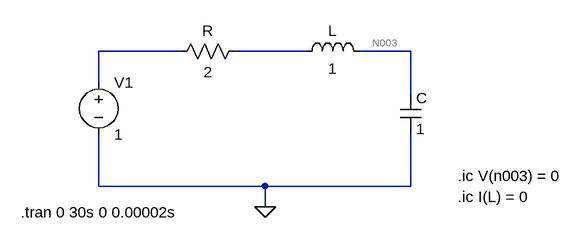
[diagram p0: schematic Q1(iii).asc]
Q1(iii).asc, the LTspice schematic file:
Version 4
SHEET 1 1360 680
WIRE 176 -208 48 -208
WIRE 368 -208 256 -208
WIRE 528 -208 448 -208
WIRE 48 -160 48 -208
WIRE 528 -144 528 -208
WIRE 48 0 48 -80
WIRE 304 0 48 0
WIRE 528 0 528 -80
WIRE 528 0 304 0
WIRE 304 32 304 0
FLAG 304 32 0
SYMBOL voltage 48 -176 R0
WINDOW 123 0 0 Left 0
WINDOW 39 0 0 Left 0
SYMATTR InstName V1
SYMATTR Value 1
SYMBOL res 272 -224 R90
WINDOW 0 0 56 VBottom 2
WINDOW 3 32 56 VTop 2
SYMATTR InstName R
SYMATTR Value 2
SYMBOL ind 464 -192 M270
WINDOW 0 32 56 VTop 2
WINDOW 3 5 56 VBottom 2
SYMATTR InstName L
SYMATTR Value 1
SYMBOL cap 512 -144 R0
SYMATTR InstName C
SYMATTR Value 1
TEXT -72 40 Left 2 !.tran 0 30s 0 0.00002s
TEXT 600 -16 Left 2 !.ic V(n003) = 0
TEXT 600 16 Left 2 !.ic I(L) = 0

The netlist it stands for:
* Q1(iii).asc
V1 N001 0 1
R N002 N001 2
L N003 N002 1
C N003 0 1
.tran 0 30s 0 0.00002s
.ic V(n003) = 0
.ic I(L) = 0
.backanno
.end